# EAGLE design DESIGN6_Layout (EAGLE 9.3.2)
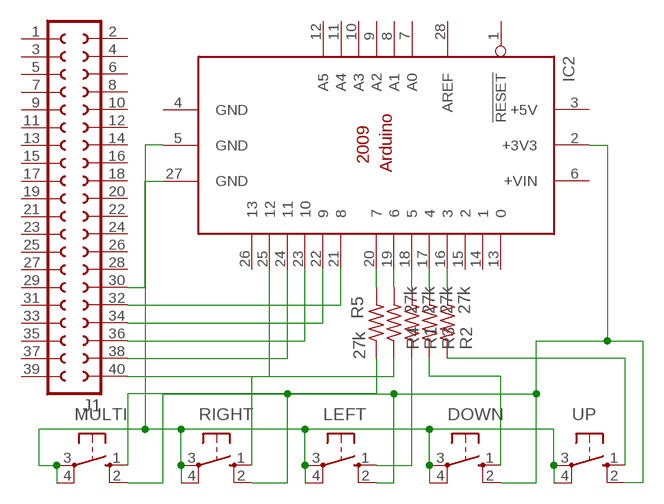
[diagram p0: schematic, sheet 1]

## Parts
DOWN  10-XX  [B3F-10XX]
IC2  ARDUINO2009_10  [ARDUINO2009]
J1  SOCKET-40V  [S40V]
LEFT  10-XX  [B3F-10XX]
MULTI  10-XX  [B3F-10XX]
R1  27k  R-US_0204/5  [0204/5]
R2  27k  R-US_0204/5  [0204/5]
R3  27k  R-US_0204/5  [0204/5]
R4  27k  R-US_0204/5  [0204/5]
R5  27k  R-US_0204/5  [0204/5]
RIGHT  10-XX  [B3F-10XX]
UP  10-XX  [B3F-10XX]

## Nets
N$1: IC2.19 R4.2
N$2: IC2.18 R1.2
N$3: IC2.25 J1.40
N$4: IC2.16 R2.2
N$5: DOWN.2(S1) IC2.2(+3V3) LEFT.2(S1) MULTI.2(S1) RIGHT.2(S1) UP.2(S1)
N$6: IC2.20 R5.2
N$7: IC2.17 R3.2
N$8: IC2.24 J1.38
N$9: IC2.23 J1.36
N$10: IC2.22 J1.34
N$11: IC2.21 J1.32
N$12: IC2.27(GND) J1.30
N$17: DOWN.3(P) DOWN.4(P1) IC2.5(GND) LEFT.3(P) LEFT.4(P1) MULTI.3(P) MULTI.4(P1) RIGHT.3(P) RIGHT.4(P1) UP.3(P) UP.4(P1)
N$18: R2.1 UP.1(S)
N$19: DOWN.1(S) R3.1
N$20: LEFT.1(S) R1.1
N$23: R4.1 RIGHT.1(S)
N$25: MULTI.1(S) R5.1
Unconnected: IC2.1(!RESET) IC2.6(+VIN) IC2.7(A0) IC2.8(A1) IC2.9(A2) IC2.10(A3) IC2.11(A4) IC2.12(A5) IC2.13 IC2.14 IC2.15 IC2.26 IC2.28(AREF) J1.1 J1.2 J1.3 J1.4 J1.5 J1.6 J1.7 J1.8 J1.9 J1.10 J1.11 J1.12 J1.13 J1.14 J1.15 J1.16 J1.17 J1.18 J1.19 J1.20 J1.21 J1.22 J1.23 J1.24 J1.25 J1.26 J1.27 J1.28 J1.29 J1.31 J1.33 J1.35 J1.37 J1.39

## Power pins joined to a net without a drawn wire
+5V: IC2.3(+5V)
GND: IC2.4(GND)

## Library data of the parts
DOWN LEFT MULTI RIGHT UP = switch-omron:10-XX: OMRON SWITCH; MPN: B3F-1000; OC_FARNELL: 176432; OC_NEWARK: 36M3542
IC2 = arduino:ARDUINO2009_1: The Arduino Duemilanove ("2009") is a microcontroller board based on the ATmega168 or ATmega328. - 14 digital input/output pins (of which 6 can be used as PWM outputs) - 6 analog inputs, a 16 MHz crystal oscillator - USB connection - power jack - ISP header - reset button It contains everything needed to support the microcontroller; simply connect it to a computer with a USB cable or power it with a AC-to-DC adapter or battery to get started http://arduino.cc/en/Main/ArduinoBoardDuemilanove
J1 = con-3m-skt-header:SOCKET-40: 40 pin PCB Socket (3m 85xx/51xx)
R1-R5 = rcl:R-US_: RESISTOR, American symbol; SPICEPREFIX: R

## Board
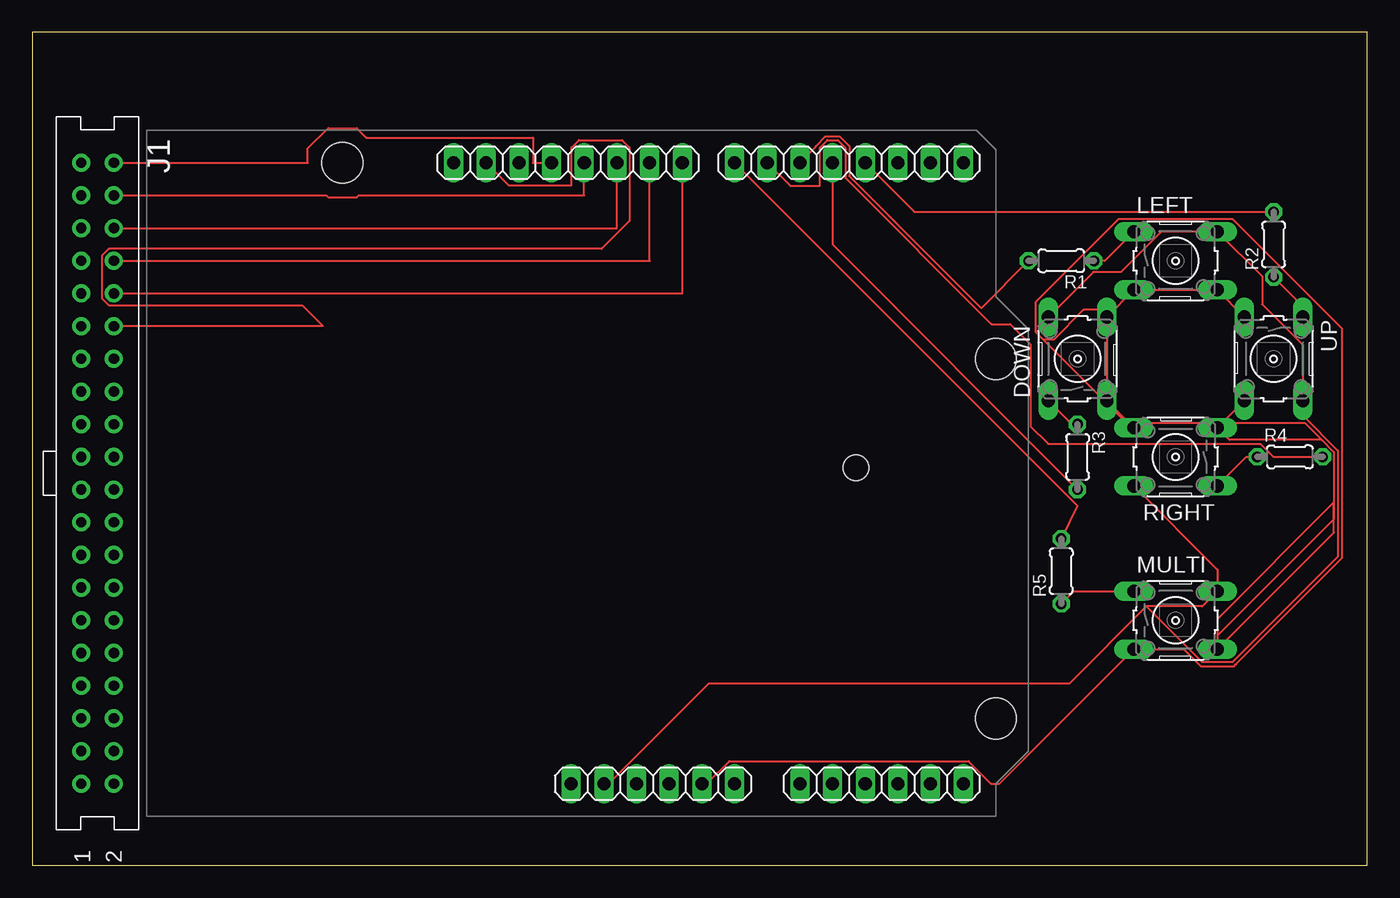
[diagram p1: board, top side]

Size 103.81 x 64.76 mm. Coordinates in mm from the lower left corner, seen from the top.
Outline: 0,0 103.81,0 103.81,64.76 0,64.76 0,0
Copper layers (1*16): Top 0.035mm / dielectric 1.5mm / Bottom 0.035mm
Design rules "default": minimum track width 6mil, minimum drill 0.35mm, track to track 6mil, track to pad 6mil, pad to pad 6mil, via to via 6mil, smd to smd 6mil, copper to edge 40mil, drill to drill 6mil, minimum pad ring 10mil, minimum via ring 8mil, stop-mask expansion 4mil, vias tented up to drill 0mil, thermal gap 10mil

### Footprints (pad centres in the part's own frame; a part is rotated, then mirrored left to right if it is on the bottom)
B3F-10XX = drill 1.016 long: 1 -3.251,2.261; 2 3.251,2.261; 3 -3.251,-2.261; 4 3.251,-2.261
ARDUINO2009 = drill 1.016 long: 1 33.02,2.54; 2 35.56,2.54; 3 38.1,2.54; 4 40.64,2.54; 5 43.18,2.54; 6 45.72,2.54; 7 50.8,2.54; 8 53.34,2.54; 9 55.88,2.54; 10 58.42,2.54; 11 60.96,2.54; 12 63.5,2.54; 13 63.5,50.8; 14 60.96,50.8; 15 58.42,50.8; 16 55.88,50.8; 17 53.34,50.8; 18 50.8,50.8; 19 48.26,50.8; 20 45.72,50.8; 21 41.656,50.8; 22 39.116,50.8; 23 36.576,50.8; 24 34.036,50.8; 25 31.496,50.8; 26 28.956,50.8; 27 26.416,50.8; 28 23.876,50.8 | hole 3.2: 15.24,50.8; 66.04,35.56; 66.04,7.62 | hole 2: 55.17,27.114
S40V = drill 0.8 pad 1.4: 1 24.13,-1.27; 2 24.13,1.27; 3 21.59,-1.27; 4 21.59,1.27; 5 19.05,-1.27; 6 19.05,1.27; 7 16.51,-1.27; 8 16.51,1.27; 9 13.97,-1.27; 10 13.97,1.27; 11 11.43,-1.27; 12 11.43,1.27; 13 8.89,-1.27; 14 8.89,1.27; 15 6.35,-1.27; 16 6.35,1.27; 17 3.81,-1.27; 18 3.81,1.27; 19 1.27,-1.27; 20 1.27,1.27; 21 -1.27,-1.27; 22 -1.27,1.27; 23 -3.81,-1.27; 24 -3.81,1.27; 25 -6.35,-1.27; 26 -6.35,1.27; 27 -8.89,-1.27; 28 -8.89,1.27; 29 -11.43,-1.27; 30 -11.43,1.27; 31 -13.97,-1.27; 32 -13.97,1.27; 33 -16.51,-1.27; 34 -16.51,1.27; 35 -19.05,-1.27; 36 -19.05,1.27; 37 -21.59,-1.27; 38 -21.59,1.27; 39 -24.13,-1.27; 40 -24.13,1.27
0204/5 = drill 0.813 octagon: 1 -2.54,0; 2 2.54,0

### Placement (x,y rotation side)
DOWN  81.28,39.37 90 top
IC2  8.89,3.81 0 top
J1  5.08,30.48 270 top
LEFT  88.9,46.99 0 top
MULTI  88.9,19.05 0 top
R1  80.01,46.99 180 top
R2  96.52,48.26 90 top
R3  81.28,31.75 270 top
R4  97.79,31.75 0 top
R5  80.01,22.86 90 top
RIGHT  88.9,31.75 180 top
UP  96.52,39.37 270 top

### Tracks (layer width: path | path; a pad name or v marks a point on that pad's centre or on a via)
N$1
  Top 0.152: IC2.19 58.95,52.8 61.24,52.8 61.24,55.78 61.82,56.36 62.64,56.36 63.22,55.78 63.22,53.44 74.6,42.06 76.04,42.06 77.62,40.48 77.62,34.14 78.99,32.77 95.49,32.77 96.51,31.75 R4.2
N$2
  Top 0.152: IC2.18 60.94,55.85 60.94,55.91 61.69,56.67 62.77,56.67 63.52,55.91 63.52,53.56 73.78,43.3 R1.2
N$3
  Top 0.152: J1.40 21.44,54.61 21.44,55.73 23.02,57.3 25.25,57.3 25.98,56.57 38.94,56.57 38.94,54.61 IC2.25
N$4
  Top 0.152: IC2.16 68.58,50.8 R2.2
N$5
  Top 0.152: DOWN.2 82.5,46.1 84.66,46.1 87.81,49.25 LEFT.2 95.63,45.77 95.63,43.61 98.78,40.46 UP.2 98.78,34.99 101.52,32.24 101.52,24 93.32,15.8 90.98,15.8 86.64,20.14 | RIGHT.2 92.15,22.99 MULTI.2 90.98,20.14 86.64,20.14 | IC2.2 44.83,6.35 52.6,14.12 80.62,14.12 86.64,20.14
N$6
  Top 0.152: IC2.20 81.28,27.94 R5.2
N$7
  Top 0.152: IC2.17 62.23,48.26 R3.2
N$8
  Top 0.152: IC2.24 42.93,52.07 25.4,52.07 25.25,51.92 23.02,51.92 22.86,52.07 J1.38
N$9
  Top 0.152: J1.36 45.47,49.53 IC2.23
N$10
  Top 0.152: J1.34 48.01,46.99 IC2.22
N$11
  Top 0.152: J1.32 50.55,44.45 IC2.21
N$12
  Top 0.152: J1.30 22.61,41.91 21,43.52 5.97,43.52 5.42,44.06 5.42,47.38 5.97,47.92 44.29,47.92 46.46,50.09 46.46,55.78 45.88,56.36 42.52,56.36 41.94,55.78 41.94,52.86 37.06,52.86 IC2.27
N$17
  Top 0.152: DOWN.4 LEFT.3 LEFT.4 UP.3 | DOWN.4 DOWN.3 RIGHT.4 | MULTI.4 92.15,19.15 101.22,28.21 | 100.27,33.07 93.09,33.07 RIGHT.3 UP.4 | 101.22,28.21 101.22,32.12 100.27,33.07 | IC2.5 52.45,6.35 54.2,8.1 72.8,8.1 74.55,6.35 75.21,6.35 MULTI.3 89.56,16.79 90.85,15.49 93.45,15.49 93.59,15.63 101.83,23.87 101.83,41.74 93.32,50.24 84.48,50.24 78.03,43.79 78.03,41.45 78.61,40.87 | 100.27,33.07 98.97,34.37 85.11,34.37 78.61,40.87 | 101.22,28.21 101.22,26.9 92.15,17.84 MULTI.4 | DOWN.4 82.98,43.18 81.74,43.18 79.43,40.87 78.61,40.87 | MULTI.4 101.22,25.86 101.22,28.21
N$18
  Top 0.152: R2.1 98.78,43.46 UP.1
N$19
  Top 0.152: DOWN.1 80.85,34.29 R3.1
N$20
  Top 0.152: LEFT.1 83.39,46.99 R1.1
N$23
  Top 0.152: RIGHT.1 94.41,31.75 R4.1
N$25
  Top 0.152: R5.1 81,21.31 MULTI.1